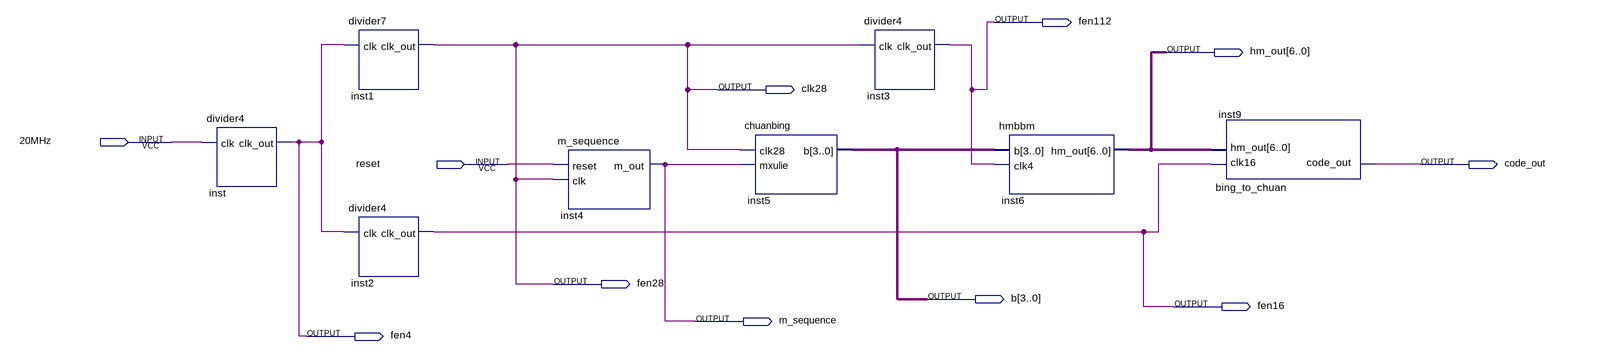
[diagram p0: schematic sheet]
// Quartus schematic hanming_code.bdf as structural Verilog: 8 symbols, 11 pins
module hanming_code (
  input  \20MHz ,
  input  reset,
  output fen112,
  output [6:0] hm_out,
  output clk28,
  output code_out,
  output fen28,
  output [3:0] b,
  output fen16,
  output m_sequence,
  output fen4
);

  divider4 inst (.clk(\20MHz ), .clk_out(fen4));
  divider7 inst1 (.clk(fen4), .clk_out(clk28));
  divider4 inst2 (.clk(fen4), .clk_out(fen16));
  m_sequence inst4 (.reset(reset), .clk(clk28), .m_out(m_sequence));
  chuanbing inst5 (.clk28(clk28), .mxulie(m_sequence), .b(b));
  divider4 inst3 (.clk(clk28), .clk_out(fen112));
  hmbbm inst6 (.b(b), .clk4(fen112), .hm_out(hm_out));
  bing_to_chuan inst9 (.clk16(fen16), .hm_out(hm_out), .code_out(code_out));

  assign fen28 = clk28;
endmodule
